# Altium schematic sheet ADC_CLK.SchDoc: {Наименование}
size 420 x 297 mm; DocumentNumber: НРДЦ.ХХХХХХ.ХХХ ХХ; SheetNumber: {}; SheetTotal: {}; PageSetup: Record=PageOptions|CenterHorizontal=False|CenterVertical=False|PrintScale=0.95|XCorrection=0.00|YCorrection=0.00|PrintKind=1|BorderSize=5000000|LeftOffset=0|BottomOffset=0|Orientation=1|PaperLength=1000|PaperWidth=1000|Scale=100|PaperSource=15|PrintQuality=600|MediaType=1|DitherType=10|PaperKind=A4|PrintScaleMode=1; Rule: PcbType=ProtelPcb
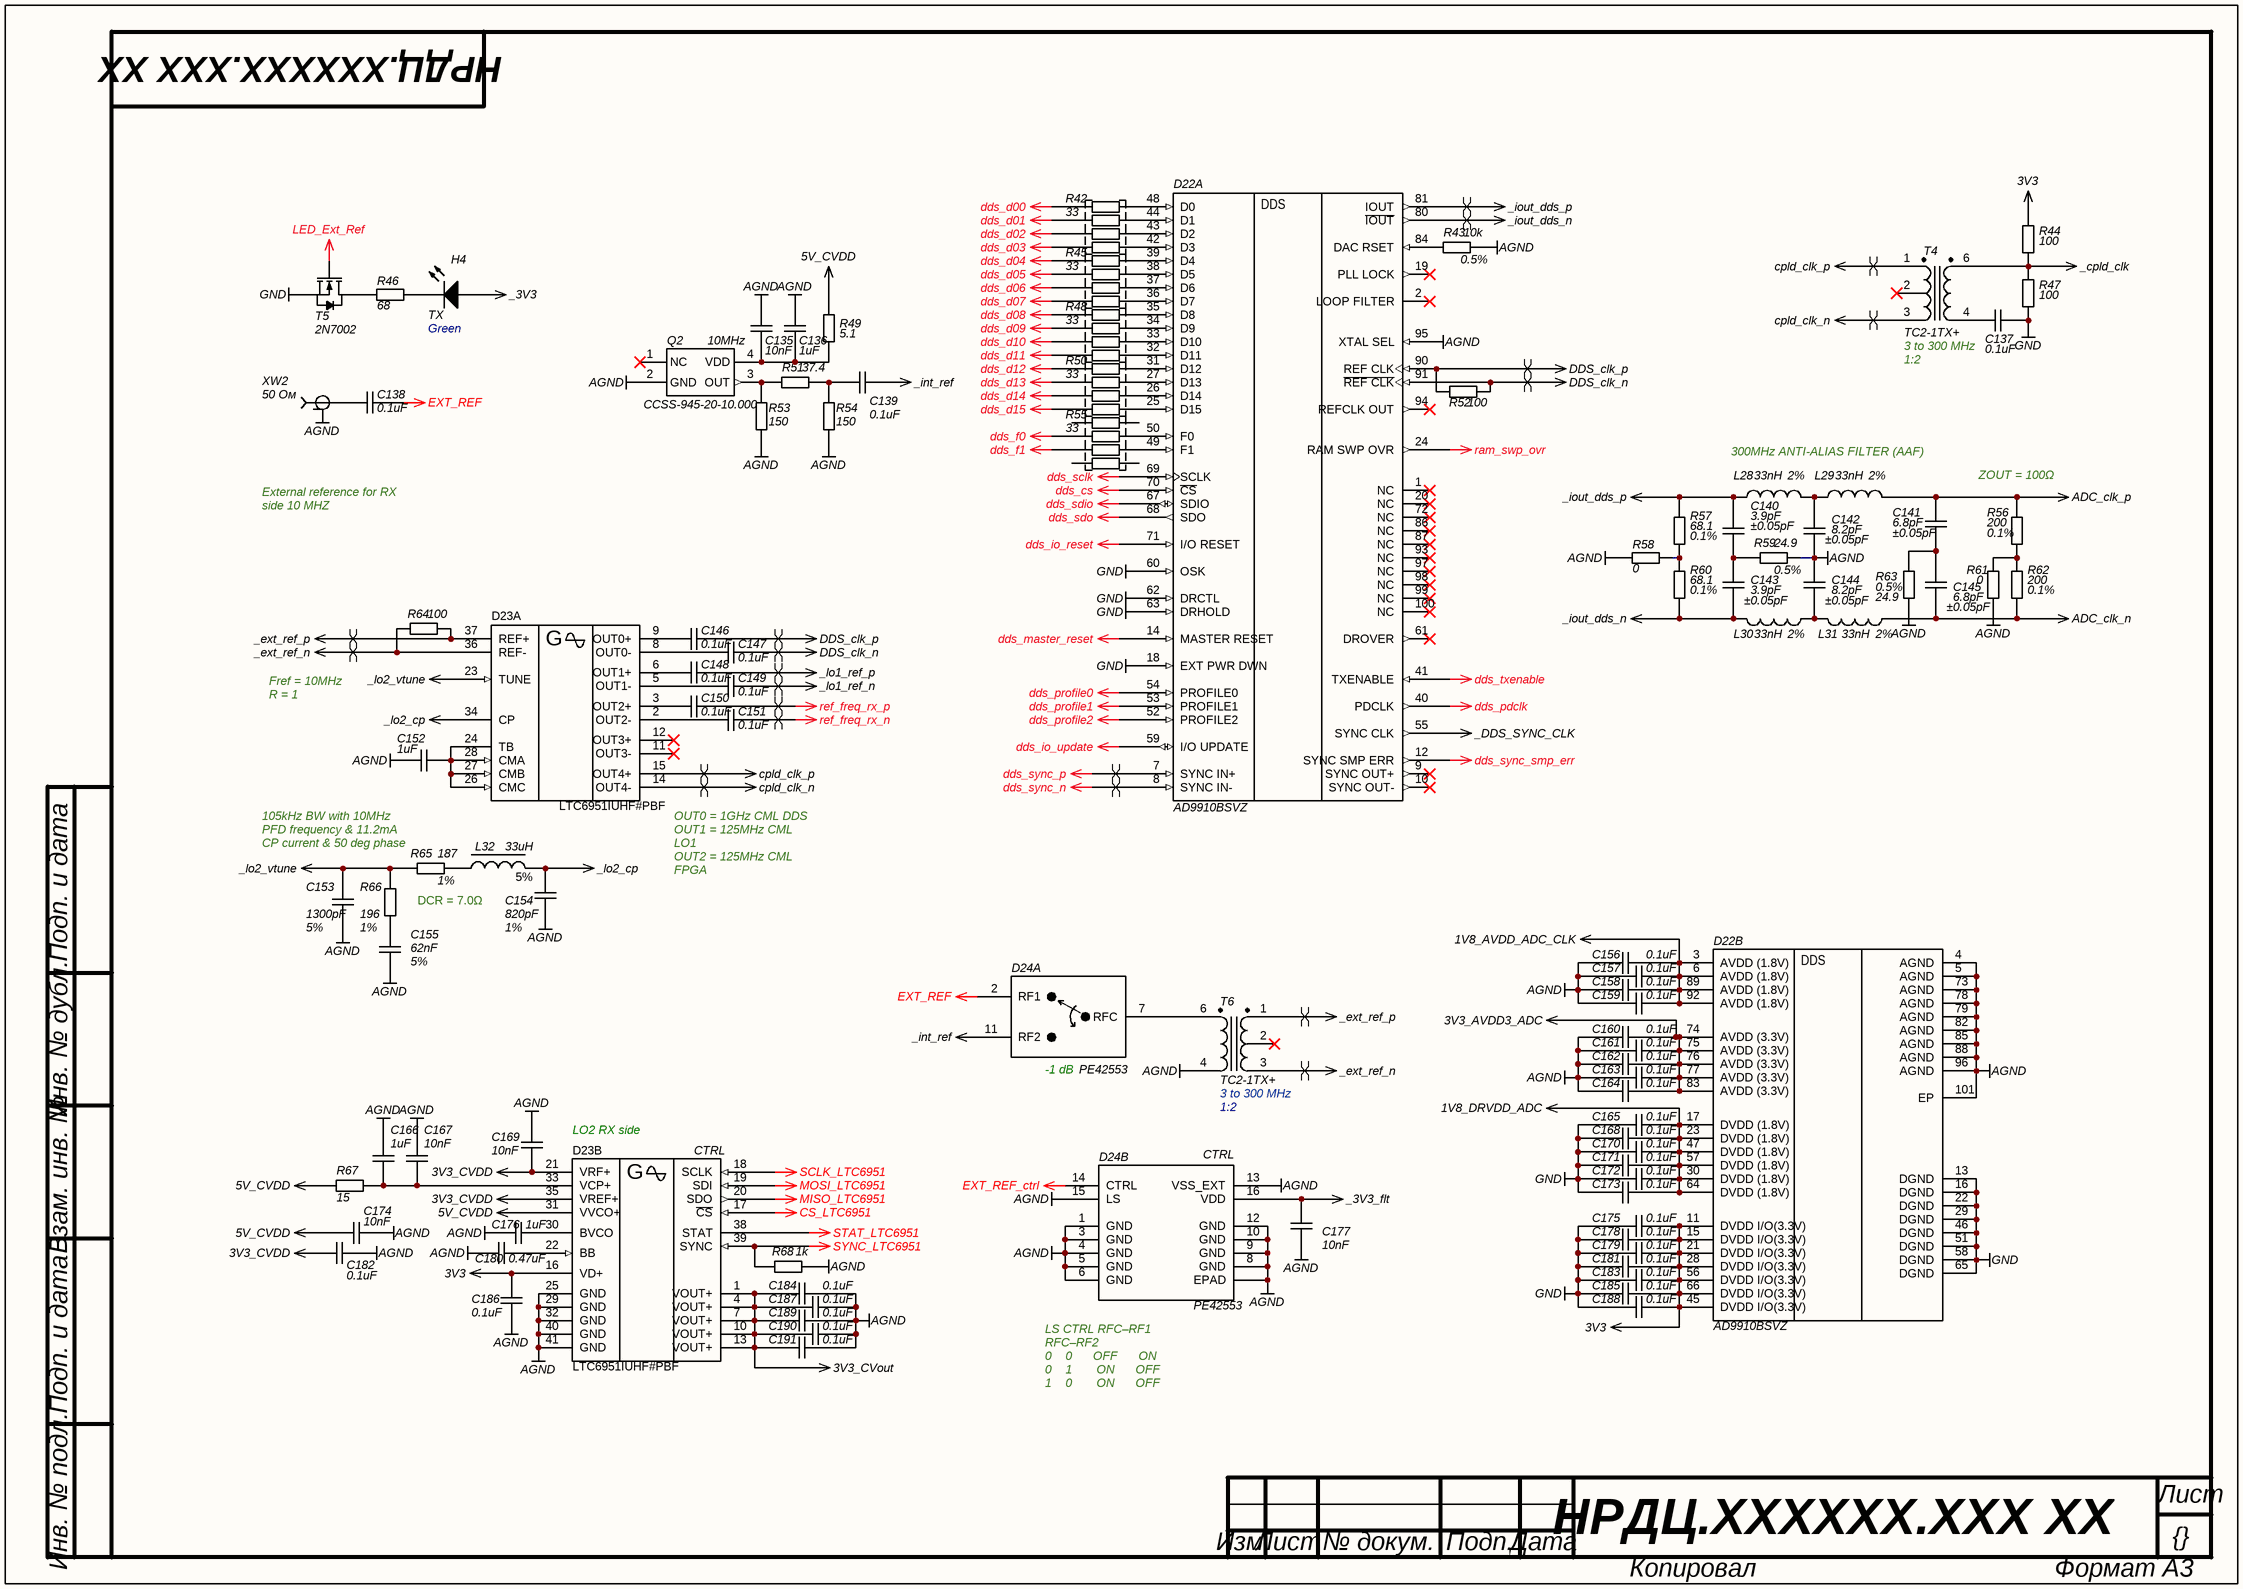
[diagram p0: ADC_CLK.SchDoc]

## Parts
C135  value 10nF  [C0402]  (hidden comment: CAP)
C136  value 1uF  [C0805]  (hidden comment: CAP)
C137  value 0.1uF  [C0402]  (hidden comment: CAP)
C138  value 0.1uF  [C0402]  (hidden comment: CAP)
C139  value 0.1uF  [C0402]  (hidden comment: CAP)
C140  value 3.9pF  Tolerance: ±0.05pF  [C0402]  (hidden comment: CAP)
C141  value 6.8pF  Tolerance: ±0.05pF  [C0402]  (hidden comment: CAP)
C142  value 8.2pF  Tolerance: ±0.05pF  [C0402]  (hidden comment: CAP)
C143  value 3.9pF  Tolerance: ±0.05pF  [C0402]  (hidden comment: CAP)
C144  value 8.2pF  Tolerance: ±0.05pF  [C0402]  (hidden comment: CAP)
C145  value 6.8pF  Tolerance: ±0.05pF  [C0402]  (hidden comment: CAP)
C146  value 0.1uF  [C0402]  (hidden comment: CAP)
C147  value 0.1uF  [C0402]  (hidden comment: CAP)
C148  value 0.1uF  [C0402]  (hidden comment: CAP)
C149  value 0.1uF  [C0402]  (hidden comment: CAP)
C150  value 0.1uF  [C0402]  (hidden comment: CAP)
C151  value 0.1uF  [C0402]  (hidden comment: CAP)
C152  value 1uF  [C0805]  (hidden comment: CAP)
C153  value 1300pF  Tolerance: 5%  [C0603]  (hidden comment: CAP)
C154  value 820pF  Tolerance: 1%  [C0603]  (hidden comment: CAP)
C155  value 62nF  Tolerance: 5%  [C1206]  (hidden comment: CAP)
C156  value 0.1uF  [C0402]  (hidden comment: CAP)
C157  value 0.1uF  [C0402]  (hidden comment: CAP)
C158  value 0.1uF  [C0402]  (hidden comment: CAP)
C159  value 0.1uF  [C0402]  (hidden comment: CAP)
C160  value 0.1uF  [C0402]  (hidden comment: CAP)
C161  value 0.1uF  [C0402]  (hidden comment: CAP)
C162  value 0.1uF  [C0402]  (hidden comment: CAP)
C163  value 0.1uF  [C0402]  (hidden comment: CAP)
C164  value 0.1uF  [C0402]  (hidden comment: CAP)
C165  value 0.1uF  [C0402]  (hidden comment: CAP)
C166  value 1uF  [C0805]  (hidden comment: CAP)
C167  value 10nF  [C0402]  (hidden comment: CAP)
C168  value 0.1uF  [C0402]  (hidden comment: CAP)
C169  value 10nF  [C0402]  (hidden comment: CAP)
C170  value 0.1uF  [C0402]  (hidden comment: CAP)
C171  value 0.1uF  [C0402]  (hidden comment: CAP)
C172  value 0.1uF  [C0402]  (hidden comment: CAP)
C173  value 0.1uF  [C0402]  (hidden comment: CAP)
C174  value 10nF  [C0402]  (hidden comment: CAP)
C175  value 0.1uF  [C0402]  (hidden comment: CAP)
C176  value 1uF  [C0805]  (hidden comment: CAP)
C177  value 10nF  [C0402]  (hidden comment: CAP)
C178  value 0.1uF  [C0402]  (hidden comment: CAP)
C179  value 0.1uF  [C0402]  (hidden comment: CAP)
C180  value 0.47uF  [C0603]  (hidden comment: CAP)
C181  value 0.1uF  [C0402]  (hidden comment: CAP)
C182  value 0.1uF  [C0402]  (hidden comment: CAP)
C183  value 0.1uF  [C0402]  (hidden comment: CAP)
C184  value 0.1uF  [C0402]  (hidden comment: CAP)
C185  value 0.1uF  [C0402]  (hidden comment: CAP)
C186  value 0.1uF  [C0402]  (hidden comment: CAP)
C187  value 0.1uF  [C0402]  (hidden comment: CAP)
C188  value 0.1uF  [C0402]  (hidden comment: CAP)
C189  value 0.1uF  [C0402]  (hidden comment: CAP)
C190  value 0.1uF  [C0402]  (hidden comment: CAP)
C191  value 0.1uF  [C0402]  (hidden comment: CAP)
D22  AD9910BSVZ  [Analog_Devices_SV-100-4_IPC_A]  (parts A,B of 2)
D23  LTC6951IUHF#PBF  [Analog_Devices_UHF-40-05-08-1951_IPC_A]  (parts A,B of 2)
D24  PE42553  [QFN-16]  (parts A,B of 2)
H4  TX  Color: Green  [LED]
L28  value 33nH  Tolerance: 2%  [L0603_HP]  (hidden comment: Inductor RF)
L29  value 33nH  Tolerance: 2%  [L0603_HP]  (hidden comment: Inductor RF)
L30  value 33nH  Tolerance: 2%  [L0603_HP]  (hidden comment: Inductor RF)
L31  value 33nH  Tolerance: 2%  [L0603_HP]  (hidden comment: Inductor RF)
L32  value 33uH  Tolerance: 5%  [L1008_LS]  (hidden comment: Inductor)
Q2  CCSS-945-20-10.000  Frequency: 10MHz  [CVCSO-914]
R42  value 33  [EXN8V]  (hidden comment: RES 4x0402)
R43  value 10k  Tolerance: 0.5%  [R0402]  (hidden comment: RES)
R44  value 100  [R0402]  (hidden comment: RES)
R45  value 33  [EXN8V]  (hidden comment: RES 4x0402)
R46  value 68  [R0402]  (hidden comment: RES)
R47  value 100  [R0402]  (hidden comment: RES)
R48  value 33  [EXN8V]  (hidden comment: RES 4x0402)
R49  value 5.1  [R0603]  (hidden comment: RES)
R50  value 33  [EXN8V]  (hidden comment: RES 4x0402)
R51  value 37.4  [R0402]  (hidden comment: RES)
R52  value 100  [R0402]  (hidden comment: RES)
R53  value 150  [R0402]  (hidden comment: RES)
R54  value 150  [R0402]  (hidden comment: RES)
R55  value 33  [EXN8V]  (hidden comment: RES 4x0402)
R56  value 200  Tolerance: 0.1%  [R0402]  (hidden comment: RES)
R57  value 68.1  Tolerance: 0.1%  [R0402]  (hidden comment: RES)
R58  value 0  [R0603]  (hidden comment: RES)
R59  value 24.9  Tolerance: 0.5%  [R0402]  (hidden comment: RES)
R60  value 68.1  Tolerance: 0.1%  [R0402]  (hidden comment: RES)
R61  value 0  [R0603]  (hidden comment: RES)
R62  value 200  Tolerance: 0.1%  [R0402]  (hidden comment: RES)
R63  value 24.9  Tolerance: 0.5%  [R0402]  (hidden comment: RES)
R64  value 100  [R0402]  (hidden comment: RES)
R65  value 187  Tolerance: 1%  [R0402]  (hidden comment: RES)
R66  value 196  Tolerance: 1%  [R0402]  (hidden comment: RES)
R67  value 15  [R0603]  (hidden comment: RES)
R68  value 1k  [R0402]  (hidden comment: RES)
T4  TC2-1TX+  Frequency: 3 to 300 MHz  Ratio: 1:2  [AT1521]
T5  2N7002  [SOT-23]
T6  TC2-1TX+  Frequency: 3 to 300 MHz  Ratio: 1:2  [AT1521]
XW2  50 Ом  [MOLEX SD-73251-135 (Gold)]

## Nets
1V8_AVDD_ADC_CLK: C156.2 C157.2 C158.2 C159.2 D22.3(AVDD_(1.8V)) D22.6(AVDD_(1.8V)) D22.89(AVDD_(1.8V)) D22.92(AVDD_(1.8V))
1V8_DRVDD_ADC: C165.2 C168.2 C170.2 C171.2 C172.2 C173.2 D22.17(DVDD_(1.8V)) D22.23(DVDD_(1.8V)) D22.30(DVDD_(1.8V)) D22.47(DVDD_(1.8V)) D22.57(DVDD_(1.8V)) D22.64(DVDD_(1.8V))
3V3: C175.2 C178.2 C179.2 C181.2 C183.2 C185.2 C186.2 C188.2 D22.11(DVDD_I/O(3.3V)) D22.15(DVDD_I/O(3.3V)) D22.21(DVDD_I/O(3.3V)) D22.28(DVDD_I/O(3.3V)) D22.45(DVDD_I/O(3.3V)) D22.56(DVDD_I/O(3.3V)) D22.66(DVDD_I/O(3.3V)) D23.16(VD+) R44.2
3V3_AVDD3_ADC: C160.2 C161.2 C162.2 C163.2 C164.2 D22.74(AVDD_(3.3V)) D22.75(AVDD_(3.3V)) D22.76(AVDD_(3.3V)) D22.77(AVDD_(3.3V)) D22.83(AVDD_(3.3V))
3V3_CVDD: C169.2 C182.2 D23.21(VRF+) D23.35(VREF+)
3V3_CVout: C184.1 C187.1 C189.1 C190.1 C191.1 D23.1(VOUT+) D23.4(VOUT+) D23.7(VOUT+) D23.10(VOUT+) D23.13(VOUT+)
5V_CVDD: C174.1 D23.31(VVCO+) R49.2 R67.2
_3V3: H4.2(A)
_3V3_flt: C177.1 D24.16(VDD)
_cpld_clk: R44.1 R47.2 T4.6
_DDS_SYNC_CLK: D22.55(SYNC_CLK)
_ext_ref_n: D23.36(REF-) R64.1 T6.3
_ext_ref_p: D23.37(REF+) R64.2 T6.1
_int_ref: C139.1 D24.11(RF2)
_iout_dds_n: C143.2 D22.80(~{IOUT}) L30.1 R60.2
_iout_dds_p: C140.1 D22.81(IOUT) L28.1 R57.1
_lo1_ref_n: C149.1
_lo1_ref_p: C148.1
_lo2_cp: C154.2 D23.34(CP) L32.2
_lo2_vtune: C153.2 D23.23(TUNE) R65.2 R66.1
ADC_clk_n: C145.2 L31.2 R62.2
ADC_clk_p: C141.1 L29.2 R56.1
AGND: C135.1 C136.1 C142.2 C144.1 C152.1 C153.1 C154.1 C155.1 C156.1 C157.1 C158.1 C159.1 C160.1 C161.1 C162.1 C163.1 C164.1 C166.1 C167.1 C169.1 C174.2 C176.1 C177.2 C180.2 C182.1 C184.2 C186.1 C187.2 C189.2 C190.2 C191.2 D22.4(AGND) D22.5(AGND) D22.73(AGND) D22.78(AGND) D22.79(AGND) D22.82(AGND) D22.85(AGND) D22.88(AGND) D22.95(XTAL_SEL) D22.96(AGND) D22.101(EP) D23.25(GND) D23.29(GND) D23.32(GND) D23.40(GND) D23.41(GND) D24.1(GND) D24.3(GND) D24.4(GND) D24.5(GND) D24.6(GND) D24.8(GND) D24.9(GND) D24.10(GND) D24.12(GND) D24.13(VSS_EXT) D24.15(LS) D24.17(EPAD) Q2.2(GND) R43.1 R53.2 R54.2 R58.1 R59.2 R61.2 R63.2 R68.1 T6.4 XW2.G(GND)
cpld_clk_n: D23.14(OUT4-) T4.3
cpld_clk_p: D23.15(OUT4+) T4.1
CS_LTC6951: D23.17(~{CS})
DDS_clk_n: C147.1 D22.91(~{REF_CLK}) R52.1
DDS_clk_p: C146.1 D22.90(REF_CLK) R52.2
dds_cs: D22.70(~{CS})
dds_d00: R42.5
dds_d01: R42.6
dds_d02: R42.7
dds_d03: R42.8
dds_d04: R45.5
dds_d05: R45.6
dds_d06: R45.7
dds_d07: R45.8
dds_d08: R48.5
dds_d09: R48.6
dds_d10: R48.7
dds_d11: R48.8
dds_d12: R50.5
dds_d13: R50.6
dds_d14: R50.7
dds_d15: R50.8
dds_f0: R55.6
dds_f1: R55.7
dds_io_reset: D22.71(I/O_RESET)
dds_io_update: D22.59(I/O_UPDATE)
dds_master_reset: D22.14(MASTER_RESET)
dds_pdclk: D22.40(PDCLK)
dds_profile0: D22.54(PROFILE0)
dds_profile1: D22.53(PROFILE1)
dds_profile2: D22.52(PROFILE2)
dds_sclk: D22.69(SCLK)
dds_sdio: D22.67(SDIO)
dds_sdo: D22.68(SDO)
dds_sync_n: D22.8(SYNC_IN-)
dds_sync_p: D22.7(SYNC_IN+)
dds_sync_smp_err: D22.12(SYNC_SMP_ERR)
dds_txenable: D22.41(TXENABLE)
EXT_REF: C138.1 D24.2(RF1)
EXT_REF_ctrl: D24.14(CTRL)
GND: C137.1 C165.1 C168.1 C170.1 C171.1 C172.1 C173.1 C175.1 C178.1 C179.1 C181.1 C183.1 C185.1 C188.1 D22.13(DGND) D22.16(DGND) D22.18(EXT_PWR_DWN) D22.22(DGND) D22.29(DGND) D22.46(DGND) D22.51(DGND) D22.58(DGND) D22.60(OSK) D22.62(DRCTL) D22.63(DRHOLD) D22.65(DGND) R47.1 T5.2(S)
LED_Ext_Ref: T5.1(G)
MISO_LTC6951: D23.20(SDO)
MOSI_LTC6951: D23.19(SDI)
ram_swp_ovr: D22.24(RAM_SWP_OVR)
ref_freq_rx_n: C151.1
ref_freq_rx_p: C150.1
SCLK_LTC6951: D23.18(SCLK)
STAT_LTC6951: D23.38(STAT)
SYNC_LTC6951: D23.39(SYNC) R68.2
NetC135_2: C135.2 C136.2 Q2.4(VDD) R49.1
NetC137_2: C137.2 T4.4
NetC138_2: C138.2 XW2.S(RF)
NetC139_2: C139.2 R51.1 R54.1
NetC140_2: C140.2 C143.1 R59.1
NetC141_2: C141.2 C145.1 R63.1
NetC142_1: C142.1 L28.2 L29.1
NetC144_2: C144.2 L30.2 L31.1
NetC146_2: C146.2 D23.9(OUT0+)
NetC147_2: C147.2 D23.8(OUT0-)
NetC148_2: C148.2 D23.6(OUT1+)
NetC149_2: C149.2 D23.5(OUT1-)
NetC150_2: C150.2 D23.3(OUT2+)
NetC151_2: C151.2 D23.2(OUT2-)
NetC152_2: C152.2 D23.24(TB) D23.26(CMC) D23.27(CMB) D23.28(CMA)
NetC155_2: C155.2 R66.2
NetC166_2: C166.2 C167.2 D23.33(VCP+) R67.1
NetC176_2: C176.2 D23.30(BVCO)
NetC180_1: C180.1 D23.22(BB)
NetD22_25: D22.25(D15) R50.1
NetD22_26: D22.26(D14) R50.2
NetD22_27: D22.27(D13) R50.3
NetD22_31: D22.31(D12) R50.4
NetD22_32: D22.32(D11) R48.1
NetD22_33: D22.33(D10) R48.2
NetD22_34: D22.34(D9) R48.3
NetD22_35: D22.35(D8) R48.4
NetD22_36: D22.36(D7) R45.1
NetD22_37: D22.37(D6) R45.2
NetD22_38: D22.38(D5) R45.3
NetD22_39: D22.39(D4) R45.4
NetD22_42: D22.42(D3) R42.1
NetD22_43: D22.43(D2) R42.2
NetD22_44: D22.44(D1) R42.3
NetD22_48: D22.48(D0) R42.4
NetD22_49: D22.49(F1) R55.2
NetD22_50: D22.50(F0) R55.3
NetD22_84: D22.84(DAC_RSET) R43.2
NetD24_7: D24.7(RFC) T6.6
NetH4_1: H4.1(K) R46.1
NetL32_1: L32.1 R65.1
NetQ2_3: Q2.3(OUT) R51.2 R53.1
NetR46_2: R46.2 T5.3(D)
NetR56_2: R56.2 R61.1 R62.1
NetR57_2: R57.2 R58.2 R60.1

Not connected (* = marked no-connect by the designer): D22 1(NC)* 2(LOOP_FILTER)* 9(SYNC_OUT+)* 10(SYNC_OUT-)* 19(PLL_LOCK)* 20(NC)* 61(DROVER)* 72(NC)* 86(NC)* 87(NC)* 93(NC)* 94(REFCLK_OUT)* 97(NC)* 98(NC)* 99(NC)* 100(NC)*; D23 11(OUT3-)* 12(OUT3+)*; Q2 1(NC)*; R55 1 4 5 8; T4 2*; T6 2*

## Layout directives
differential pair: _ext_ref_n, _ext_ref_p, _iout_dds_n, _iout_dds_p, _lo1_ref_n, _lo1_ref_p, cpld_clk_n, cpld_clk_p, DDS_clk_n, DDS_clk_p, dds_sync_n, dds_sync_p, ref_freq_rx_n, ref_freq_rx_p

## Notes on the sheet
- External reference for RX side 10 MHZ
- 300MHz ANTI-ALIAS FILTER (AAF)
- ZOUT = 100Ω
- Fref = 10MHz
  R = 1
- (near R65) 105kHz BW with 10MHz PFD frequency & 11.2mA CP current & 50 deg phase margin
- DCR = 7.0Ω
- (near D23) OUT0 = 1GHz CML DDS
  OUT1 = 125MHz CML LO1
  OUT2 = 125MHz CML FPGA
  OUT3 = NC CML
  OUT4 = 62.5MHz LVDS CPLD
- LO2 RX side
- (near D24) LS CTRL RFC–RF1 RFC–RF2
  0    0      OFF      ON
  0    1       ON      OFF
  1    0       ON      OFF
  1    1      OFF      ON
- Подп. и дата
- Инв. № дубл.
- Взам. инв. №
- Инв. № подл.
- Лист
- Изм.
- № докум.
- Подп.
- Дата
- Копировал
- Формат А3
- (in symbol AD9910, part A) DDS
- (in symbol AD9910, part B) DDS
- (in symbol LTC6951, part A) G
- (in symbol LTC6951, part B) CTRL; G
- (in symbol PE42553, part A) -1 dB

## Library data of the parts
C135 C167 C169 C174 C177 = CAP: SMD Capacitor; Manufacturer: Murata; Material: X7R; Tolerance: 10%; Voltage: 25V; Type: Ceramic Capacitor; P/N: GRM155R71E103KA01D
C136 C152 C166 C176 = CAP: SMD Capacitor; Manufacturer: Murata; Material: X7R; Tolerance: 10%; Voltage: 10V; Type: Ceramic Capacitor; P/N: GRM21BR71A105KA01K
C137-C139 C146-C151 C182 C186 = CAP: SMD Capacitor; Manufacturer: Murata; Material: X7R; Tolerance: 10%; Voltage: 10V; Type: Ceramic Capacitor; P/N: GRM155R71A104KA01J
C140 C143 = CAP: SMD Capacitor; Manufacturer: Murata; Material: NP0; Voltage: 50V; Type: Ceramic Capacitor; P/N: GJM1555C1H3R9WB01D
C141 C145 = CAP: SMD Capacitor; Manufacturer: Murata; Material: NP0; Voltage: 50V; Type: Ceramic Capacitor; P/N: GJM1555C1H6R8WB01D
C142 C144 = CAP: SMD Capacitor; Manufacturer: Murata; Material: NP0; Voltage: 50V; Type: Ceramic Capacitor; P/N: GJM1555C1H8R2WB01D
C153 = CAP: SMD Capacitor; Manufacturer: Murata; Material: NP0; Voltage: 50V; Type: Ceramic Capacitor; P/N: GRM1885C1H132JA01D
C154 = CAP: SMD Capacitor; Manufacturer: Murata; Material: NP0; Voltage: 100V; Type: Ceramic Capacitor; P/N: GCM1885C2A821FA16D
C155 = CAP: SMD Capacitor; Manufacturer: Murata; Material: NP0; Voltage: 50V; Type: Ceramic Capacitor; P/N: GRM31C5C1H623JA01K
C156-C165 C168 C170-C173 C175 C178 C179 C181 C183-C185 C187-C191 = CAP: SMD Capacitor; Manufacturer: Murata; Material: X7R; Tolerance: 10%; Voltage: 16V; Type: Ceramic Capacitor; P/N: GRM155R71C104KA88J
C180 = CAP: SMD Capacitor; Manufacturer: Murata; Material: X7R; Tolerance: 10%; Voltage: 16V; Type: Ceramic Capacitor; P/N: GCM188R71C474KA55D
D22 = AD9910: 1 GSPS, 14-Bit, 3.3 V CMOS / Direct Digital Synthesizer; P/N: AD9910BSVZ; Name: AD9910
D23 = LTC6951: Ultralow Jitter / Multioutput Clock Synthesizer / with Integrated VCO; Name: LTC6951; P/N: LTC6951IUHF#PBF
D24 = PE42553: HaRPTM technology-enhanced absorptive SPDT; Manufacturer: Peregrine Technical Solutions; P/N: PE42553A-Z; Type: SPDT RF Switch; Name: PE42553; Package: 16-lead 3 × 3 mm QFN; Supplier 1: Digi-Key; Supplier Part Number 1: 1046-1137-1-ND
H4 = LED: CHIP LED LAMP; Manufacturer: Kingbright; Name: APHCM2012; P/N: APHCM2012CGCK-F01; Package: 2.0 x 1.25 mm SMD; Type: CHIP LED LAMP; Supplier 1: Digi-Key; Supplier Part Number 1: 754-1094-1-ND
L28-L31 = Inductor RF: Chip SMD Inductor; Manufacturer: Coilcraft; Current: 680mA; Frequency: 2.7GHz; Name: 0603HP-33NXGE; Series: 0603HP; Temperature Range: -25…85°C; P/N: 0603HP-33NXGE
L32 = Inductor: Chip SMD Inductor; Manufacturer: Coilcraft; Current: 200mA; Frequency: 32MHz; Name: 1008LS; P/N: 1008LS-333XJE; DCR: 7.0Ω; Series: 1008LS; Temperature Range: -25…85°C
Q2 = CCSS-945: Ultra Low Noise / SineWave Clock Oscillator; Input Current: 15mA Typical; Name: CCSS-945-10; Output: Unsymmetry; Output Current: ±24mA Max; Voltage: 5.0V; Package: 9×14 mm SMD; Temperature Range: 0°C to +70°C; P/N: CCSS-945-20-10.000; Type: SineWave Clock Oscillator
R42 R45 R48 R50 R55 = RES 4x0402: Chip Resistor Array; Manufacturer: Panasonic; Name: EXBN8V; Number of Resistors: 4; Tolerance: 5%; P/N: ERJ-2GEJ330X; Type: 0402 Array Concave Terminal; Number of Terminals: 8; Series: EXB
R43 = RES: SMD Resistor; Manufacturer: Panasonic Electronic Components; Name: Chip SMD Resistor; Power: 0.063 Wt; P/N: ERA-2AED103X; Temperature Range: -55…155°C
R44 R47 R52 R64 = RES: SMD Resistor; Manufacturer: Panasonic Electronic Components; Name: Chip SMD Resistor; Power: 0.062 Wt; Tolerance: 5%; P/N: ERJ-2GEJ101X; Temperature Range: -55…155°C
R46 = RES: SMD Resistor; Name: Chip SMD Resistor; Power: 0.062 Wt; Tolerance: 5%; P/N: ERJ-2GEJ680X; Temperature Range: -55…155°C
R49 = RES: SMD Resistor; Name: Chip SMD Resistor; Power: 0.1 Wt; Tolerance: 5%; P/N: ERJ-2GEJ5R1X; Temperature Range: -55…155°C
R51 = RES: SMD Resistor; Manufacturer: Panasonic Electronic Components; Name: Chip SMD Resistor; Power: 0.062 Wt; Tolerance: 5%; P/N: ERJ-2RKF37R4X; Temperature Range: -55…155°C
R53 R54 = RES: SMD Resistor; Manufacturer: Panasonic Electronic Components; Name: Chip SMD Resistor; Power: 0.062 Wt; Tolerance: 1%; P/N: ERJ-2RKF1500X; Temperature Range: -55…155°C
R56 R62 = RES: SMD Resistor; Manufacturer: Panasonic Electronic Components; Name: Chip SMD Resistor; Power: 0.063 Wt; P/N: ERA-2AEB201X; Temperature Range: -55…155°C
R57 R60 = RES: SMD Resistor; Manufacturer: Panasonic Electronic Components; Name: Chip SMD Resistor; Power: 0.063 Wt; P/N: ERA-2AEB68R1X; Temperature Range: -55…155°C
R58 R61 = RES: SMD Resistor; Name: Chip SMD Resistor; Power: 0.1 Wt; Tolerance: 1%; P/N: ERJ-2GE0R00X; Temperature Range: -55…155°C
R59 R63 = RES: SMD Resistor; Manufacturer: Panasonic Electronic Components; Name: Chip SMD Resistor; Power: 0.063 Wt; P/N: ERJ-2RKD24R9X; Temperature Range: -55…155°C
R65 = RES: SMD Resistor; Manufacturer: Panasonic Electronic Components; Name: Chip SMD Resistor; Power: 0.2 Wt; P/N: ERJ-2RKF1870X; Temperature Range: -55…155°C
R66 = RES: SMD Resistor; Manufacturer: Panasonic Electronic Components; Name: Chip SMD Resistor; Power: 0.2 Wt; P/N: ERJ-2RKF1960X; Temperature Range: -55…155°C
R67 = RES: SMD Resistor; Name: Chip SMD Resistor; Power: 0.1 Wt; Tolerance: 1%; P/N: ERJ-3EKF15R0V; Temperature Range: -55…155°C
R68 = RES: SMD Resistor; Manufacturer: Panasonic Electronic Components; Name: Chip SMD Resistor; Power: 0.062 Wt; Tolerance: 5%; P/N: ERJ-2GEJ102X; Temperature Range: -55…155°C
T4 T6 = TC2-1TX+: RF Transformer; Manufacturer: Mini-Circuits; Name: TC2-1TX+; P/N: TC2-1TX+; Type: RF Transformer; Package: AT1521
T5 = 2N7002: N-Channel MOSFET 2N7002; Channel Resistance: 5Ohm; Current: 300mA; Power Dissipation: 0.83W; Voltage: 60V; Name: 2N7002; Type: SOT-23; Package: SOT-23
XW2 = RF Connector: 50 Ohms, SMA Jack, Vertica; Manufacturer: Molex; Impedance: 50Ω; P/N: 0732511352; Name: SMA Jack; Type: 50 Ohms, SMA Jack, Vertical, PCB SMT, Gold (Au) Body; Supplier 1: Digi-Key; Supplier Part Number 1: WM9458-ND